# Altium project PowerBoard6.PrjPcb
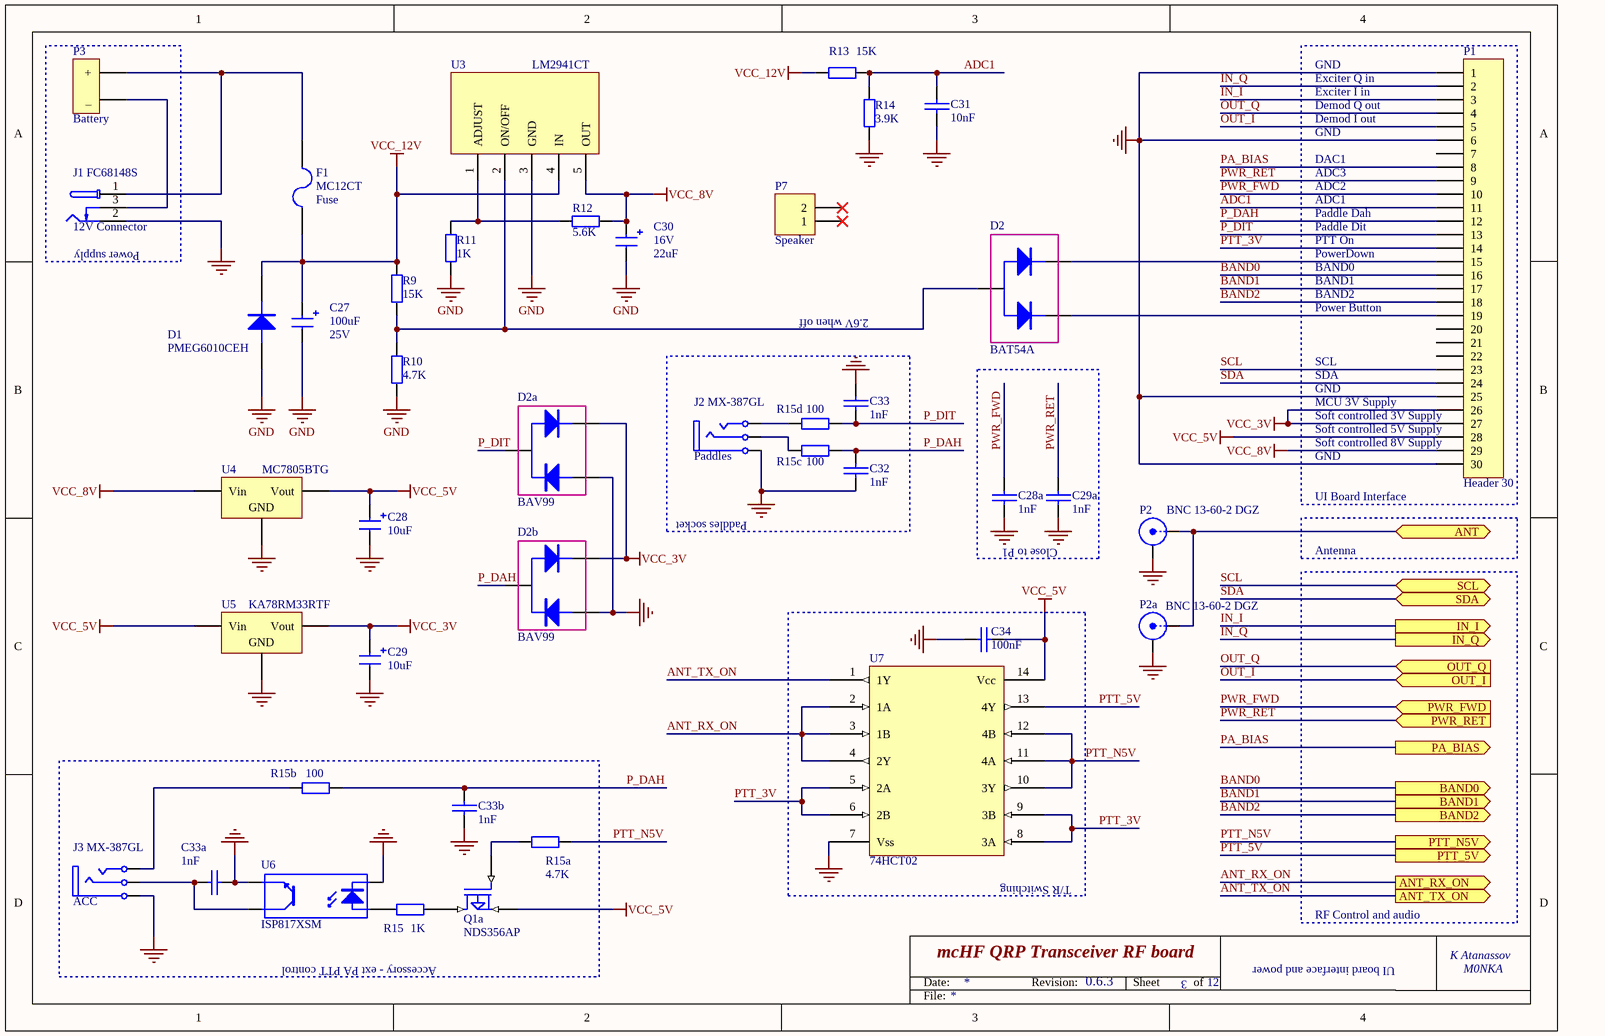
[diagram p0: power6.SchDoc]
1 sheet, 42 parts. Net scope: flat (ports and power ports of the same name join across sheets).

## Sheet power6.SchDoc: mcHF QRP Transceiver RF board
size A4; Author: K Atanassov; CompanyName: M0NKA; Revision: 0.6.3; SheetTotal: 12

### Parts
C27  100uF  Voltage: 25V  [CAP_ALUM_1]
C28  10uF  [1206_Elec_Cap_N]
C28a  1nF  [0805-Pro]
C29  10uF  [1206_Elec_Cap_N]
C29a  1nF  [0805-Pro]
C30  22uF  Voltage: 16V  [1206_Elec_Cap_N]
C31  10nF  [0805-Pro]
C32  1nF  [0805-Pro]
C33  1nF  [0805-Pro]
C33a  1nF  [0805-Pro]
C33b  1nF  [0805-Pro]
C34  100nF  [0805-Pro]
D1  PMEG6010CEH  [SOD87]
D2  BAT54A  [SOT-23]
D2a  BAV99  [SOT-23]
D2b  BAV99  [SOT-23]
F1  MC12CT  [1206]
J1  FC68148S  Function: 12V Connector  [PowerJack]
J2  MX-387GL  Function: Paddles  [MX-387GL_new1]
J3  MX-387GL  Function: ACC  [MX-387GL_new1]
P1  Header 30  [HDR1X30]
P2  BNC 13-60-2 DGZ  [CON-SMA-RA-A]
P2a  BNC 13-60-2 DGZ  [BNC_RA CON]
P3  Battery  [BatteryTerminal]  (no BOM)
P7  Speaker  [SIP2]
Q1a  NDS356AP  [SOT-23-Pro]
R9  15K  [0805-Pro]
R10  4.7K  [0805-Pro]
R11  1K  [0805-Pro]
R12  5.6K  [0805-Pro]
R13  15K  [0805-Pro]
R14  3.9K  [0805-Pro]
R15  1K  [0805-Pro]
R15a  4.7K  [0805-Pro]
R15b  100  [0805-Pro]
R15c  100  [0805-Pro]
R15d  100  [0805-Pro]
U3  LM2941CT  [TO-220-5]
U4  MC7805BTG  [TO-220]
U5  KA78RM33RTF  [TO-252]
U6  ISP817XSM  [SMDIP-4_new1]
U7  74HCT02  [SO-14-Pro]

### Blocks framed on the sheet
Power supply: J1 P3
Paddles socket: C32 C33 J2 R15c R15d
Close to P1: C28a C29a
T/R Switching: C34 U7
Accessory - ext PA PTT control: C33a C33b J3 Q1a R15 R15a R15b U6

### Ports
ANT (bidir), ANT_RX_ON (out), ANT_TX_ON (out), BAND0 (out), BAND1 (out), BAND2 (out), IN_I (out), IN_Q (out), OUT_I (in), OUT_Q (in), PA_BIAS (out), PTT_5V (out), PTT_N5V (out), PWR_FWD (in), PWR_RET (in), SCL (bidir), SDA (bidir)

### Nets
GND: C27.2 C28.2 C28a.1 C29.2 C29a.1 C30.2 C31.2 C32.1 C33.2 C33a.1 C33b.2 C34.2 D1.1(A) D2a.1(A1) D2b.1(A1) J1.2 J2.S J3.S P1.1 P1.6 P1.25 P1.30 P2.2(Y) P2a.2(Y) R10.2 R11.1 R14.2 U3.3(GND) U4.2(GND) U5.2(GND) U6.2(K) U6.3(E) U7.7(Vss)
VCC_3V: C29.1 D2a.2(K1) D2b.2(K1) P1.26 P1.27 U5.3(Vout)
VCC_5V: C28.1 C34.1 P1.28 Q1a.2(S) U4.3(Vout) U5.1(Vin) U7.14(Vcc)
VCC_8V: C30.1 P1.29 R12.2 U3.5(OUT) U4.1(Vin)
VCC_12V: C27.1 D1.2(K) F1.1 R9.2 R13.1 U3.4(IN)
ADC1: C31.1 P1.11 R13.2 R14.1
ANT_RX_ON: U7.2(1A) U7.3(1B) U7.4(2Y) ; port ANT_RX_ON
ANT_TX_ON: U7.1(1Y) ; port ANT_TX_ON
BAND0: P1.16 ; port BAND0
BAND1: P1.17 ; port BAND1
BAND2: P1.18 ; port BAND2
IN_I: P1.3 ; port IN_I
IN_Q: P1.2 ; port IN_Q
OUT_I: P1.5 ; port OUT_I
OUT_Q: P1.4 ; port OUT_Q
P_DAH: C32.2 C33b.1 D2b.3(C) P1.12 R15b.1 R15c.1
P_DIT: C33.1 D2a.3(C) P1.13 R15d.1
PA_BIAS: P1.8 ; port PA_BIAS
PTT_3V: P1.14 U7.5(2A) U7.6(2B) U7.8(3A) U7.9(3B)
PTT_5V: U7.13(4Y) ; port PTT_5V
PTT_N5V: R15a.2 U7.10(3Y) U7.11(4A) U7.12(4B) ; port PTT_N5V
PWR_FWD: C28a.2 P1.10 ; port PWR_FWD
PWR_RET: C29a.2 P1.9 ; port PWR_RET
SCL: P1.23 ; port SCL
SDA: P1.24 ; port SDA
NetC33a_2: C33a.2 J3.R U6.4(C)
NetD2_1: D2.1(K1) P1.19
NetD2_2: D2.2(K2) P1.15
NetD2_3: D2.3(A) R9.1 R10.1 U3.2(ON/OFF)
NetF1_2: F1.2 J1.1 P3.1(+)
NetJ1_3: J1.3 P3.2(_)
NetJ2_R: J2.R R15c.2
NetJ2_T: J2.T R15d.2
NetJ3_T: J3.T R15b.2
NetP2_1: P2.1(X) P2a.1(X) ; port ANT
NetQ1a_1: Q1a.1(G) R15a.1
NetQ1a_3: Q1a.3(D) R15.2
NetR11_2: R11.2 R12.1 U3.1(ADJUST)
NetR15_1: R15.1 U6.1(A)

Not connected (* = marked no-connect by the designer): P1 7 20 21 22; P7 1* 2*

### Notes on the sheet
- GND
- Exciter I in
- Exciter Q in
- Demod Q out
- Demod I out
- DAC1
- ADC3
- ADC2
- ADC1
- Paddle Dit
- Paddle Dah
- PTT On
- 2.6V when off
- PowerDown
- BAND0
- BAND1
- BAND2
- Power Button
- SCL
- SDA
- MCU 3V Supply
- (near P1) Soft controlled 3V Supply
- (near P1) Soft controlled 5V Supply
- (near P1) Soft controlled 8V Supply
- (near P1) UI Board Interface
- Antenna
- RF Control and audio
- 3
- UI board interface and power
- Date:
- Revision:
- Sheet
- of
- File:

### Library data of the parts
C27 = CAP-POL: Electrolitic capacitor; Order: FN 206-9181; QT Order: QCC-00323; Price: 0.37
C28 C29 = CAP-POL: Electrolitic capacitor; Order: FN 233-3009; QT Order: QCC-00166; Price: 0.204
C28a C29a C32 C33 C33a C33b = CAP: Capacitor; Order: FN 136-2553; QT Order: QCC-00259; Price: 0.01
C30 = CAP-POL: Electrolitic capacitor; Order: FN 197-294; QT Order: QCC-00202; Price: 0.235
C31 = CAP: Capacitor; Order: FN 233-2713; QT Order: QCC-00097; Price: 0.059
C34 = CAP: Capacitor; Order: FN 252-2090; QT Order: QCC-00154; Price: 0.068
D1 = PMEG6010CEH: DIODE, SCHOTTKY, 1A, 60V, SOD-123F; Order: FN 151-0694; QT Order: QCD-00034; Price: 0.085
D2 = BAT54A: DIODE, SCHOTTKY, DUAL; Order: FN 108-1191; Price: 0.024
D2a D2b = BAV99: Small Signal Diode, Dual Series; Order: FN 162-1837; Price: 0.0618
F1 = Fuse: Order: FN 184-1065; QT Order: QCI-00216; Price: 0.134; Function: Fuse
J1 = POWER_JACK: Power Jack; Order: FN 188-9309; Price: 0.83
J2 J3 = Phonejack3: Jack Socket,Thru-Hole; Order: FN 126-7376; Price: 0.35
P1 = Header 30: Header, 30-Pin; Order: EB 290947876334; Price: 0.295
P2 P2a = BNC: RF COAXIAL, BNC, JACK; Order: FN 171-2350; Price: 0.69
P3 = Battery: Battery Terminal
P7 = Header 2: Header, 2-Pin; Order: FN 168-3898; Checked: NA; Price: 5.57
Q1a = NDS356AP: Order: FN 984-6409; QT Order: QCT-00010; Price: 0.31
R9 R13 = RES: Resistor; Order: FN 165-2920; QT Order: QCR-00353; Price: 0.065
R10 R15a = RES: Resistor; Order: FN 200-8383; QT Order: QCR-00341; Price: 0.024
R11 R15 = RES: Resistor; Order: FN 157-6459; QT Order: QCR-00326; Price: 0.061
R12 = RES: Resistor; Order: FN 188-7301; QT Order: QCR-00343; Price: 0.043
R14 = RES: Resistor; Order: FN 165-2998; QT Order: QCR-00339; Price: 0.012
R15b R15c R15d = RES: Resistor; Order: FN 933-2375; QT Order: QCR-00301; Price: 0.027
U3 = LM2941CT: V REG ADJ +5/20V, 2941, TO-220-5; Order: FN 948-9371; Price: 1.28
U4 = MC7805BTG: VOLTAGE REG, 40V, TO220-3; Order: FN 121-1135; Price: 0.56
U5 = UA78M33CKVURG3: VOLT REG, 3.3V, TO-252; Order: FN 245-1041; Price: 0.39
U6 = ISP817XSM: OPTOCOUPLER, SMDIP-4, TR O/P; Order: FN 168-3292; Price: 0.26
U7 = 74HCT02: Quad 2-input NOR gate; Order: FN 108-5298; Price: 0.38